# EasyEDA Pro project 直插稳压隔离辅助电源.epro

# Schematic Schematic1
Board Name: Board1; Create Date: 2026-04-16; Page Name: P1; Project Name: 稳压隔离辅助电源; Schematic Name: Schematic1; Update Date: 2026-04-16; Company: 嘉立创EDA; Page Size: A4; Version: V1.0
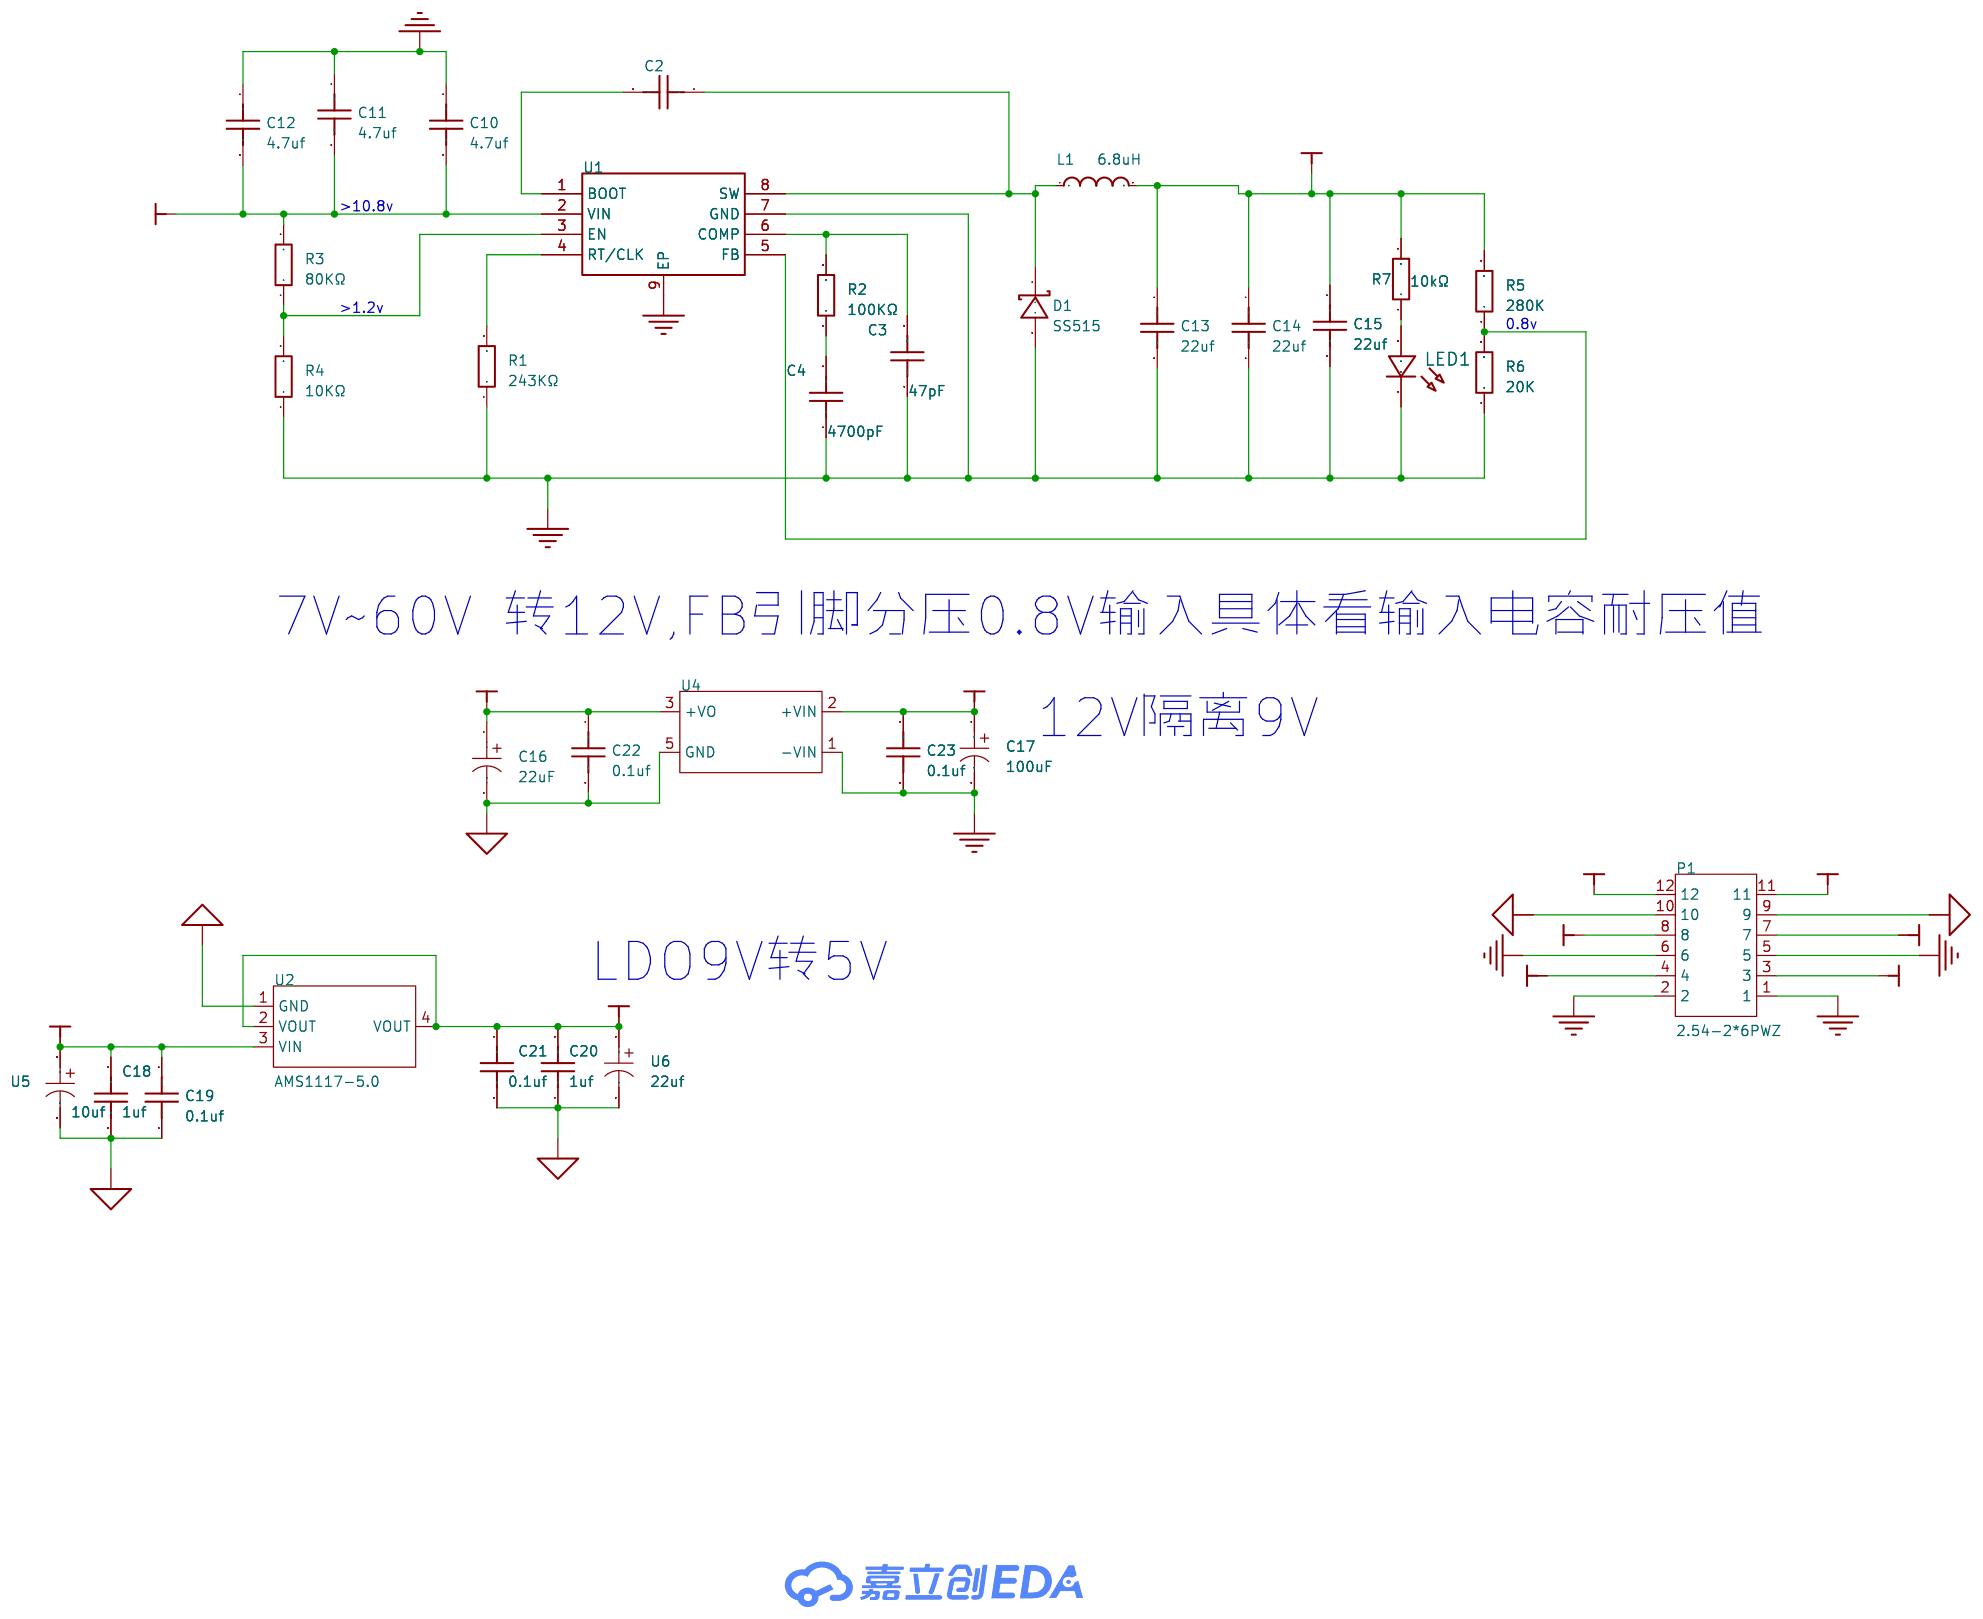
[diagram p0: schematic sheet]

## Parts
C2  100nF  [C0603]
C3  47pF  [C0603]
C4  4700pF  [C0603]
C10  4.7uf  [C0603]
C11  4.7uf  [C0603]
C12  4.7uf  [C0603]
C13  22uf  [C0603]
C14  22uf  [C0603]
C15  22uf  [C0603]
C16  22uF  [CAP-TH_BD8.0-P3.50-D0.6-FD_1]
C17  100uF  [CAP-TH_BD10.0-P5.00-D0.6-FD_H16.0]
C18  1uf  [C0603]
C19  0.1uf  [C0603]
C20  1uf  [C0603]
C21  0.1uf  [C0603]
C22  0.1uf  [C0603]
C23  0.1uf  [C0603]
D1  SS515  [SMA_L4.3-W2.6-LS5.2-RD]
L1  6.8uH  [IND-SMD_L7.1-W6.6]
LED1  -  [LED_0603]
P1  2.54-2*6PWZ  [HDR-TH_12P-P2.54-H-M-R2-C6-S2.54-W12.5]
R1  243KΩ  [R0603]
R2  100KΩ  [R0603]
R3  80KΩ  [R0603]
R4  10KΩ  [R0603]
R5  280K  [R0603]
R6  20K  [R0603]
R7  10kΩ  [电阻（0603）]
U1  TPS54560DDAR  [SOIC-8_L5.0-W4.0-P1.27-LS6.0-BL-EP2.0]
U2  AMS1117-5.0  [SOT-223_L6.5-W3.5-P2.30-LS7.0-BR]
U4  250kHz  [PWRM-TH_HI-LINK_VRBXXYMD-5WR3-1]
U5  10uf  [CAP-SMD_L3.5-W2.8-FD]
U6  22uf  [CAP-SMD_L3.5-W2.8-FD]

## Library data of the parts
C2-C4 C10-C15 C18-C23 = CAP_0603: Supplier Footprint: 0603
C16 = EGW2CM220F12OT: 容值:22uF;精度:±20%;额定电压:160V;纹波电流:-;等效串联电阻(ESR):-;; LCSC Part Name: 22uF ±20% 160V; Supplier Part: C720969; Manufacturer: AISHI(艾华集团); Supplier Footprint: 插件,D8xL12mm; JLCPCB Part Class: 扩展库; Supplier: LCSC; Tolerance: ±20%; Voltage Rating: 160V; Diameter: 8mm; Height - Seated (Max): 12mm
C17 = ERA100V100M10X16: 容值:100uF;精度:±20%;额定电压:100V;; LCSC Part Name: 100uF ±20% 100V; Supplier Part: C49256825; Manufacturer: JIERR(捷而瑞); Supplier Footprint: 插件,D10xL16mm; JLCPCB Part Class: 扩展库; Datasheet: https://item.szlcsc.com/datasheet/ERA100V100M10X16/51692225.html; Supplier: LCSC; Tolerance: ±20%; Voltage Rating: 100V; Pin Spacing: 5mm; Diameter: 10mm; Height - Seated (Max): 16mm; Lifetime: 2000hrs@105℃; Operating Temperature: -40℃~+105℃
D1 = SS3200: 正向压降(Vf):950mV@3A;直流反向耐压(Vr):200V;平均整流电流(Io):3A;; Supplier: LCSC; Manufacturer: MDD; Supplier Part: C65001; JLCPCB Part Class: 扩展库; LCSC Part Name: 电压:200V 电流:3A; Supplier Footprint: SMA(DO-214AC); Datasheet: https://atta.szlcsc.com/upload/public/pdf/source/20230314/A80AE34493C69B89E2F4B1712F433538.pdf; Forward Voltage (Vf@If): 950mV@3A; Reverse Voltage (Vr): 200V; Average Rectified Current (Io): 3A; Reverse Leakage Current (Ir): 200uA@200V
L1 = D0630HP-100MT: 电感值:10uH;精度:±20%;饱和电流(Isat):4.5A;类型:一体成型电感;; LCSC Part Name: 一体成型电感 0630-10UH 10uH ±20%; Supplier Part: C41410464; Manufacturer: DEYAN(德砚电子); Supplier Footprint: SMD,7.1x6.6mm; JLCPCB Part Class: 扩展库; Datasheet: https://atta.szlcsc.com/upload/public/pdf/source/20240919/F778D1314CA22AE212FE584D5C4D76CB.pdf; Supplier: LCSC; Tolerance: ±20%; Current - Saturation (Isat): 4.5A; DC Resistance (DCR): 68mΩ; Type: 一体成型电感
LED1 = LED_0603-R: Supplier Footprint: 0603
P1 = 2.54-2*6PWZ: 插针结构:2x6P;间距:2.54mm;行距:2.54mm;圆针/方针:方针;安装方式:弯插;排数:双排;总PIN位数:12P;额定电流:3A;额定电压:-;配合针长度:-;塑高:-;触头材质:黄铜;触头镀层:-;工作温度:-40℃~+105℃;颜色:黑色;; LCSC Part Name: 2x6P 间距:2.54mm 方针 弯插; Supplier Part: C60565; Manufacturer: BOOMELE(博穆精密); Supplier Footprint: 弯插,P=2.54mm; JLCPCB Part Class: 扩展库; Supplier: LCSC; Pin Structure: 2x6P; Pitch: 2.54mm; Row Spacing: 2.54mm; Circluar Pins/Square Pins: 方针; Mounting Type: 弯插; Number of Rows: 双排; Number of Pins: 12P; Current Rating: 3A; Contact Material: 黄铜; Operating Temperature: -40℃~+105℃; Color: 黑色
R1-R6 = Res_0603: Supplier Footprint: 0603
R7 = 0805W8F5101T5E: 电阻类型:厚膜电阻;阻值:5.1kΩ;精度:±1%;功率:125mW;最大工作电压:150V;温度系数:±100ppm/℃;; LCSC Part Name: 5.1kΩ ±1% 125mW 厚膜电阻; Supplier Part: C27834; Manufacturer: UNI-ROYAL(厚声); Supplier Footprint: 0805; JLCPCB Part Class: Basic Part; Datasheet: https://atta.szlcsc.com/upload/public/pdf/source/20200306/C422600_1E6D84923E4A46A82E41ADD87F860B5C.pdf; Supplier: LCSC; Type: 厚膜电阻; Tolerance: ±1%; Power(Watts): 125mW; Overload Voltage (Max): 150V; Temperature Coefficient: ±100ppm/℃; Operating Temperature Range: -55℃~+155℃
U1 = TPS54560DDAR: 功能类型:降压型;输出类型:可调;工作电压:4.5V~60V;输出电压:800mV~58.8V;输出电流:5A;; LCSC Part Name: 4.5V至60V输入,5A降压DC-DC转换器; Supplier Part: C31966; Manufacturer: TI(德州仪器); Supplier Footprint: SOIC-8-EP; JLCPCB Part Class: 扩展库; Datasheet: https://www.ti.com/cn/lit/gpn/tps54560; Supplier: LCSC; Function: 降压型; Output Type: 可调; Input Voltage: 4.5V~60V; Output Voltage: 800mV~58.8V; Output Current: 5A; Switching Frequency: 2.5MHz; Operating Temperature: -40℃~+150℃@(TJ); Synchronous Rectification: 否; Number of Outputs: 1; Topology: 降压式; Switch tube (built-in/external): 内置
U2 = AMS1117-5.0_C6187: 输出类型:固定;工作电压:15V;输出电压:5V;输出电流:1A;电源纹波抑制比(PSRR):60dB;输出极性:正极;; LCSC Part Name: 输入15V 输出5V 1A; Supplier Part: C6187; Manufacturer: AMS; Supplier Footprint: SOT-223; JLCPCB Part Class: 基础库; Datasheet: https://item.szlcsc.com/datasheet/AMS1117-5.0/6653.html; Supplier: LCSC; Output Type: 固定; Voltage - Supply: 15V; Output Voltage: 5V; Output Current: 1A; Power Supply Rejection Ratio (PSRR): 60dB; Voltage Dropout: 1.3V; Operating Temperature: -40℃~+125℃; Output Configuration: 正极; Number of Outputs: 1
U4 = VRB1205YMD-5WR3: 5W宽电压输入、隔离稳压单/双输出、DIP封装的DC-DC电源模块。VR(A)B_YMD 5WR3系列产品输出功率为5W，输入电压范围宽达2:1，效率高达84%，常规隔离电压为1500VDC，允许工作温度范围为-40°C至+85°C，具备输出过压、过流和短路保护功能。; LCSC Part Name: 直流隔离电源模块12V转5V短路保护; Supplier Part: C5365320; Manufacturer: HI-LINK(海凌科); Supplier Footprint: DIP,25.4x25.4mm; JLCPCB Part Class: 扩展库; Datasheet: https://item.szlcsc.com/datasheet/VRB1205YMD-5WR3/6196411.html; Supplier: LCSC; Output Power: 5W; Voltage - Supply: 9V~18V; Conversion Efficiency: 84%; Output Voltage: 5V; Output Current(Max): 1A; Capacitive Load(Max): 2200uF; Isolation Voltage(Vrms): 1.5kV; Features: 过流保护；短路保护; Operating Temperature: -40℃~+85℃; Ripple Noise: 50mVp-p; Length: 25.4mm; Width: 25.4mm; Height: 11mm
U5 U6 = 贴片钽电容100uF+-20%6.3VB型: Supplier Part: C9900014621; JLCPCB Part Class: 扩展库; Supplier: LCSC

## Nets
+5V: C20.1 C21.1 P1.11 P1.12 U2.2(VOUT) U2.4(VOUT) U6.1
+9V: C16.1 C18.1 C19.1 C22.1 U2.3(VIN) U4.3(+VO) U5.1
+12V: C13.1 C14.1 C15.1 C17.1 C23.1 L1.2 P1.7 P1.8 R5.2 R7.2 U4.2(+VIN)
AGND: C16.2 C18.2 C19.2 C20.2 C21.2 C22.2 P1.9 P1.10 U2.1(GND) U4.5(GND) U5.2 U6.2
GND: C3.1 C4.1 C10.1 C11.1 C12.1 C13.2 C14.2 C15.2 C17.2 C23.2 D1.2(A) LED1.1(C) P1.1 P1.2 P1.5 P1.6 R1.1 R4.1 R6.1 U1.7(GND) U1.9(EP) U4.1(-VIN)
VCC_IN: C10.2 C11.2 C12.2 P1.3 P1.4 R3.2 U1.2(VIN)
$1N848: R3.1 R4.2 U1.3(EN)
$1N849: C2.2 U1.1(BOOT)
$1N852: R1.2 U1.4(RT/CLK)
$1N853: C3.2 R2.2 U1.6(COMP)
$1N854: R5.1 R6.2 U1.5(FB)
$1N856: C2.1 D1.1(K) L1.1 U1.8(SW)
$1N857: LED1.2(A) R7.1
$1N858: C4.2 R2.1

## Notes on the sheet
- >10.8v
- >1.2v
- 0.8v
- 7V~60V 转12V,FB引脚分压0.8V
- 输入具体看输入电容耐压值
- 12V隔离9V
- LDO9V转5V

# Board PCB1
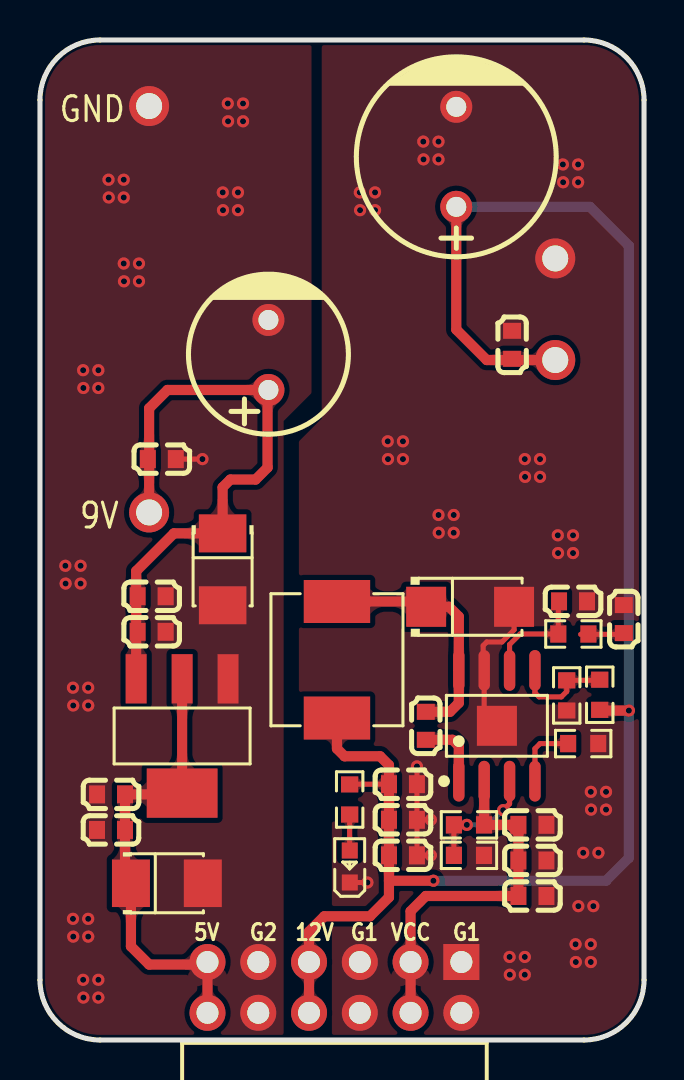
[diagram p1: board, top side]
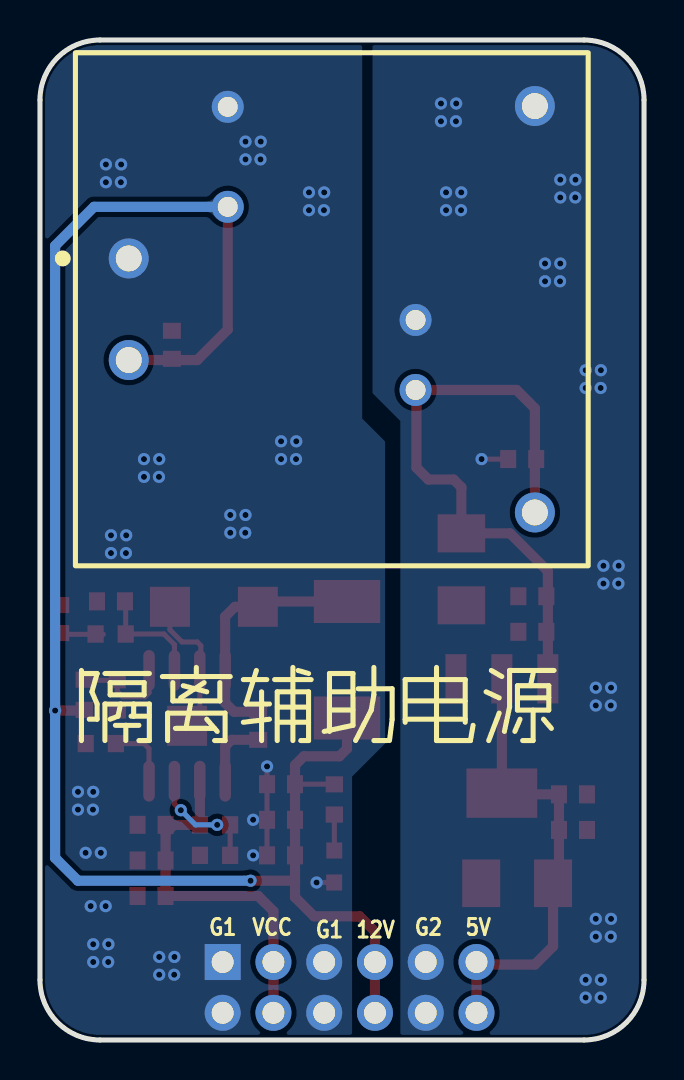
[diagram p2: board, bottom side, seen from below]

Outline 30.22 x 50 mm; copper layers: Top Layer, Bottom Layer. Coordinates in mm from the lower left corner of the outline.
Outline path: 0,47 0,3 arc(0.88,0.88) 3,0 27.22,0 arc(29.34,0.88) 30.22,3 30.22,47 arc(29.34,49.12) 27.22,50 3,50 arc(0.88,49.12) 0,47
Stack: Top Layer 0.035mm / Dielectric1 1.51mm FR4 er 4.5 / Bottom Layer 0.035mm

## Design rules (mm)
template: 自定义配置
spacing copperThickness1oz (default): track to track 0.102, other pairs 0.152 to 0.3
spacing copperThickness2oz: track to track 0.203, other pairs 0.152 to 0.3
track width copperThickness1oz (default): min 0.127, default 0.254, max 2.54
track width copperThickness2oz: min 0.203, default 0.254, max 2.54
differential pair differentialPair (default): width min 0.127, default 0.254, max 2.54; gap min 0.152, default 0.152
via viaSize (default): diameter min 0.5, default 0.61, max 10; hole min 0.3, default 0.305, max 6.3

## Placement (name value [footprint] x y rotation side)
C2  100nF  [C0603]  19.3 15.71 270 top
C3  47pF  [C0603]  26.67 21.93 180 top
C4  4700pF  [C0603]  29.21 21.04 270 top
C10  4.7uf  [C0603]  24.64 10.76 180 top
C11  4.7uf  [C0603]  24.64 8.98 180 top
C12  4.7uf  [C0603]  24.64 7.2 180 top
C13  22uf  [C0603]  18.16 9.23 0 top
C14  22uf  [C0603]  18.16 11.01 0 top
C15  22uf  [C0603]  18.16 12.79 0 top
C16  22uF  [CAP-TH_BD8.0-P3.50-D0.6-FD_1]  11.43 34.25 90 top
C17  100uF  [CAP-TH_BD10.0-P5.00-D0.6-FD_H16.0]  20.83 44.16 90 top
C18  1uf  [C0603]  5.59 22.19 0 top
C19  0.1uf  [C0603]  5.59 20.41 0 top
C20  1uf  [C0603]  3.55 10.5 180 top
C21  0.1uf  [C0603]  3.56 12.28 180 top
C22  0.1uf  [C0603]  6.1 29.05 0 top
C23  0.1uf  [C0603]  23.62 34.76 90 top
D1  SS515  [SMA_L4.3-W2.6-LS5.2-RD]  21.52 21.66 0 top
L1  6.8uH  [IND-SMD_L7.1-W6.6]  14.86 19.01 270 top
LED1  -  [LED_0603]  15.49 8.73 90 top
P1  2.54-2*6PWZ  [HDR-TH_12P-P2.54-H-M-R2-C6-S2.54-W12.5]  14.73 2.63 0 top
R1  243KΩ  [R0603]  27.18 14.82 180 top
R2  100KΩ  [R0603]  26.69 20.3 180 top
R3  80KΩ  [R0603]  21.46 10.76 0 top
R4  10KΩ  [R0603]  21.46 9.23 180 top
R5  280K  [R0603]  28.01 17.26 270 top
R6  20K  [R0603]  26.35 17.23 90 top
R7  10kΩ  [电阻（0603）]  15.49 12.03 90 top
U1  TPS54560DDAR  [SOIC-8_L5.0-W4.0-P1.27-LS6.0-BL-EP2.0]  22.86 15.71 0 top
U2  AMS1117-5.0  [SOT-223_L6.5-W3.5-P2.30-LS7.0-BR]  7.11 15.2 90 top
U4  250kHz  [PWRM-TH_HI-LINK_VRBXXYMD-5WR3-1]  15.62 36.54 180 bottom
U5  10uf  [CAP-SMD_L3.5-W2.8-FD]  9.14 23.53 270 top
U6  22uf  [CAP-SMD_L3.5-W2.8-FD]  6.35 7.84 0 top

## Footprints (pads in the part's own frame, mm; a bottom-side part is the same pattern mirrored in y, then rotated)
C0603
  rect 0.8x0.9 smd: 1(-0.7,0) 2(0.7,0)
CAP-SMD_L3.5-W2.8-FD
  rect 1.9x2.376 smd: 1(-1.798,0) 2(1.798,0)
CAP-TH_BD8.0-P3.50-D0.6-FD_1
  round 1.6 hole 1: 1(-1.75,0) 2(1.75,0)
CAP-TH_BD10.0-P5.00-D0.6-FD_H16.0
  round 1.6 hole 1: 1(-2.5,0) 2(2.5,0)
HDR-TH_12P-P2.54-H-M-R2-C6-S2.54-W12.5
  rect 1.8x1.8 hole 1.1: 1(6.35,1.27)
  round 1.8 hole 1.1: 2(6.35,-1.27) 3(3.81,1.27) 4(3.81,-1.27) 5(1.27,1.27) 6(1.27,-1.27) 7(-1.27,1.27) 8(-1.27,-1.27) 9(-3.81,1.27) 10(-3.81,-1.27) 11(-6.35,1.27) 12(-6.35,-1.27)
IND-SMD_L7.1-W6.6
  rect 2.15x3.32 smd: 1(-2.913,0) 2(2.913,0)
LED_0603
  rect 0.8x0.8 smd: 1(-0.851,-0.01) 2(0.75,-0.005)
PWRM-TH_HI-LINK_VRBXXYMD-5WR3-1
  round 2 hole 1.3: 1(-10.16,2.54) 2(-10.16,-2.54) 3(10.16,-10.16) 5(10.16,10.16)
R0603
  rect 0.806x0.864 smd: 1(-0.753,0) 2(0.753,0)
SMA_L4.3-W2.6-LS5.2-RD
  rect 2x2 smd: 1(-2.2,0) 2(2.2,0)
SOIC-8_L5.0-W4.0-P1.27-LS6.0-BL-EP2.0
  oval 0.574x2.038 smd: 1(-1.905,-2.769) 2(-0.635,-2.769) 3(0.635,-2.769) 4(1.905,-2.769) 5(1.905,2.769) 6(0.635,2.769) 7(-0.635,2.769) 8(-1.905,2.769)
  rect 2x2 smd: 9(0,0)
SOT-223_L6.5-W3.5-P2.30-LS7.0-BR
  rect 2.465x1.05 smd: 1(2.857,-2.3) 2(2.857,0) 3(2.857,2.3)
  rect 2.465x3.54 smd: 4(-2.857,0)
电阻（0603）
  rect 0.806x0.864 smd: 1(-0.754,0) 2(0.752,0)

## Nets
As in the schematic.

## Via types
v1: diameter 0.61, hole 0.305, Top Layer to Bottom Layer, 89 vias

## Routing (per net, layer and track width the routed paths; a pad name or vN(x,y) marks a point on that pad's centre or on a via; arc(x,y) is an arc through that point)
+5V: length 23.1
  Top Layer w0.508: U2.2 U2.4 7.05,12.28 C21.1 4.26,8.13 U6.1 4.55,4.68 5.46,3.77 8.38,3.77 8.38,1.23
+9V: length 30.9
  Top Layer w0.508: U4.3 5.46,31.59 6.38,32.5 C16.1 11.39,32.46 11.39,28.62 10.79,28.02 9.53,28.02 9.14,27.64 U5.1 6.7,25.33 4.81,23.44 4.81,18.06
+12V: length 87.6
  Top Layer w0.254: C15.1 15.5,12.79 R7.2
  Top Layer w0.508: 17.46,7.96 C13.1 C14.1 C15.1 17.46,13.74 17.02,14.19 15.24,14.19 14.86,14.57 L1.2 ; 17.46,7.96 17.46,7.14 16.51,6.19 14.22,6.19 13.46,5.42 13.46,1.23 ; 17.46,7.96 v1(19.69,7.96) ; v1(29.46,16.47) 28.04,16.47 ; U4.2 22.35,34 20.83,35.52 C17.1
  Bottom Layer w0.508: v1(19.69,7.96) 28.32,7.96 29.46,9.11 v1(29.46,16.47) 29.46,39.71 27.52,41.66 C17.1
AGND: length 1.3
  Top Layer w0.254: C22.2 v1(8.13,29.05)
  vias: v1(1.27,23.71) v1(1.28,22.82) v1(1.65,17.62) v1(1.66,16.73) v1(1.65,6.06) v1(1.66,5.17) v1(2.03,23.71) v1(2.03,22.82) v1(2.16,33.49) v1(2.17,32.6) v1(2.16,3.01) v1(2.17,2.12) v1(2.41,17.62) v1(2.41,16.73) v1(2.41,6.06) v1(2.41,5.17) v1(2.92,33.49) v1(2.92,32.6) v1(2.92,3.01) v1(2.92,2.12) v1(3.43,43.02) v1(3.44,42.13) v1(4.19,43.02) v1(4.19,42.13) v1(4.19,38.82) v1(4.2,37.94) v1(4.95,38.82) v1(4.95,37.94) v1(9.14,42.38) v1(9.16,41.49) v1(9.4,46.83) v1(9.41,45.94) v1(9.91,42.38) v1(9.91,41.49) v1(10.16,46.83) v1(10.16,45.94)
GND: length 13.3
  Top Layer w0.254: v1(19.56,9.23) C13.2 C14.2 ; 22.36,16.21 22.22,16.35 U1.7 22.17,18.53 22.17,19.72 22.35,19.9 23.11,19.9 23.72,20.51 D1.2 ; C14.2 C15.2 v1(18.86,13.68) ; C14.2 v1(19.56,11.01) ; LED1.1 v1(16.38,7.87)
  vias: v1(16,42.38) v1(16.01,41.49) v1(16.76,42.38) v1(16.76,41.49) v1(17.4,29.93) v1(17.41,29.05) v1(18.16,29.93) v1(18.16,29.05) v1(19.18,44.92) v1(19.19,44.03) v1(19.94,44.92) v1(19.94,44.03) v1(19.94,26.25) v1(19.95,25.36) v1(20.7,26.25) v1(20.7,25.36) v1(23.5,4.15) v1(23.51,3.26) v1(24.26,29.05) v1(24.27,28.16) v1(24.26,4.15) v1(24.26,3.26) v1(25.02,29.05) v1(25.02,28.16) v1(25.91,25.24) v1(25.92,24.35) v1(26.16,43.78) v1(26.17,42.89) v1(26.67,25.24) v1(26.67,24.35) v1(26.8,4.79) v1(26.81,3.9) v1(26.92,43.78) v1(26.92,42.89) v1(26.94,6.69) v1(27.18,9.36) v1(27.56,12.41) v1(27.57,11.52) v1(27.56,4.79) v1(27.56,3.9) v1(27.69,6.69) v1(27.94,9.36) v1(28.32,12.41) v1(28.32,11.52)
VCC_IN: length 18.6
  Top Layer w0.508: 22.22,10.77 22.23,10.76 23.52,10.76 ; 22.22,10.77 U1.2 ; 22.22,10.77 R3.2 ; 23.52,10.76 23.94,10.34 23.94,7.2 19.3,7.2 18.54,6.44 18.54,1.23 ; 23.52,10.76 23.94,10.76
$1N848: length 5.9
  Top Layer w0.254: v1(21.36,10.76) R3.1 R4.2 ; v1(23.18,11.49) 23.5,11.81 U1.3
  Bottom Layer w0.254: v1(23.18,11.49) 22.44,10.76 v1(21.36,10.76)
$1N849: length 3.5
  Top Layer w0.508: U1.1 20.96,14.69 20.64,15.01 C2.2
$1N852: length 3.4
  Top Layer w0.254: R1.2 25.02,14.82 24.76,14.57 U1.4
$1N853: length 5.6
  Top Layer w0.254: U1.6 23.5,19.77 24.02,20.3 R2.2 25.93,21.9 C3.2
$1N854: length 5.1
  Top Layer w0.254: U1.5 24.76,17.36 24.97,17.16 26.09,17.16 26.35,17.43 R6.2 27.97,17.98 28.01,18.01
$1N856: length 12.3
  Top Layer w0.508: C2.1 20.51,16.41 20.96,16.85 U1.8 20.96,21.17 20.47,21.66 19.57,21.66 ; D1.1 19.06,21.93 L1.1
$1N857: length 1.8
  Top Layer w0.254: R7.1 15.49,9.48 LED1.2
$1N858: length 2.2
  Top Layer w0.254: 27.05,20.28 29.15,20.28 C4.2

## Copper pours and planes (outline as drawn; the poured copper is in the pictures)
AGND on Top Layer: 12.19,-10.07 12.19,30.95 13.59,32.35 13.59,51.78 11.05,54.32 -1.78,54.32 -3.43,52.67 -3.43,-7.66 0.38,-11.47 10.79,-11.47
AGND on Bottom Layer: 12.19,-10.07 12.19,30.95 13.59,32.35 13.59,51.78 11.05,54.32 -1.78,54.32 -3.43,52.67 -3.43,-7.66 0.38,-11.47 10.79,-11.47
GND on Top Layer: 14.6,13.17 12.95,14.82 12.95,29.93 14.1,31.08 14.1,53.56 18.16,57.62 31.5,57.62 34.67,54.45 34.67,-6.39 30.1,-10.96 15.88,-10.96 14.6,-9.69
GND on Bottom Layer: 14.6,13.17 12.95,14.82 12.95,29.93 14.1,31.08 14.1,53.56 18.16,57.62 31.5,57.62 34.67,54.45 34.67,-6.39 30.1,-10.96 15.88,-10.96 14.6,-9.69

Small or netless copper shapes (teardrops, artwork), in the pictures only: 98 on Top Layer, 6 on Bottom Layer

## Text on the board
Bottom Silkscreen Layer: 5V | G2 | 12V | G1 | VCC | 隔离辅助电源
Top Silkscreen Layer: 5V | G2 | 12V | G1 | VCC | GND | 9V
